# EAGLE schematic crossover (EAGLE 5.07)
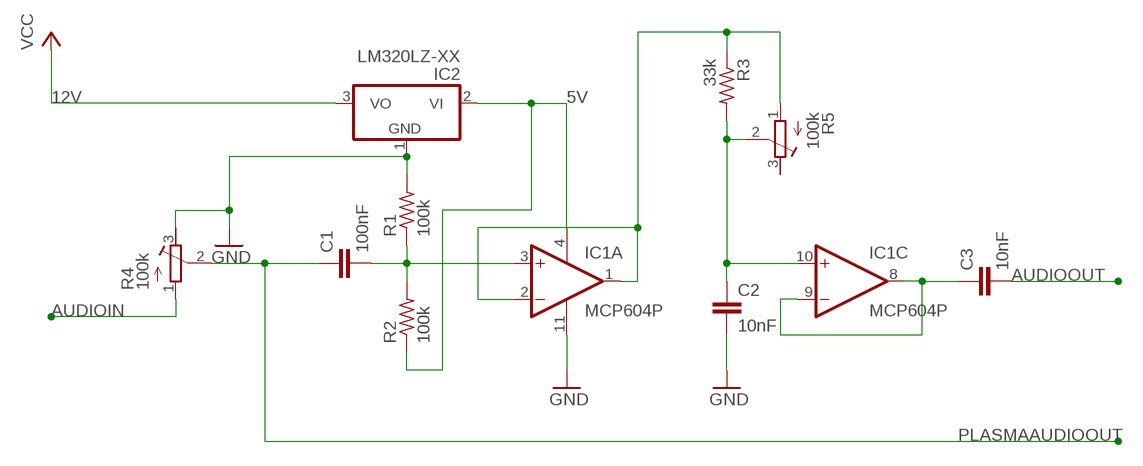
[diagram p0: schematic, sheet 1]

## Parts
C1  100nF  C-EU025_050-035X075  [C025_050-035X075]
C2  10nF  C-EU025_050-035X075  [C025_050-035X075]
C3  10nF  C-EU025_050-035X075  [C025_050-035X075]
IC1  MCP604P  [DIL14]
IC2  LM320LZ-XX  [TO92]
R1  100k  R-US_0204/2V  [0204V]
R2  100k  R-US_0204/2V  [0204V]
R3  33k  R-US_0204/2V  [0204V]
R4  100k  R-TRIMM5W  [RTRIM5W]
R5  100k  R-TRIMM5W  [RTRIM5W]

## Nets
5V: IC1.4(P:V+) IC2.2(VI) R2.1
12V: IC2.3(VO) ; supply symbol labelled VCC
AUDIOIN: R4.1(E)
AUDIOOUT: C3.2
GND: C2.2 IC1.11(P:V-) IC2.1(GND) R1.2 R4.3(A)
N$5: C1.2 IC1.3(A:+IN) R1.1 R2.2
N$6: C3.1 IC1.8(C:OUT) IC1.9(C:-IN)
N$7: C2.1 IC1.10(C:+IN) R3.2 R5.2(S)
N$8: IC1.1(A:OUT) IC1.2(A:-IN) R3.1 R5.1(E)
PLASMAAUDIOOUT: C1.1 R4.2(S)
Unconnected: IC1.5(B:+IN) IC1.6(B:-IN) IC1.7(B:OUT) IC1.12(D:+IN) IC1.13(D:-IN) IC1.14(D:OUT) R5.3(A)

## Library data of the parts
C1-C3 = resistor:C-EU: CAPACITOR, European symbol
IC1 = linear:MCP604: Quad Op Amp 2.7V to 6.0V Single Supply CMOS Source: http://ww1.microchip.com/downloads/en/DeviceDoc/21314g.pdf
IC2 = linear:LM320LZ-XX: Negative VOLTAGE REGULATOR
R1-R3 = resistor:R-US_: RESISTOR, American symbol
R4 R5 = resistor:R-TRIMM: Trimm resistor